# Altium schematic sheet SCH-Jamme.SchDoc: JAMMER
size A2; Address1: Seyyed Mohammad Sadr; Address2: msadr471@gmail.com; Address3: Electronics.mihanblog.com; DocumentNumber: 1; SheetNumber: 1; SheetTotal: Sadr
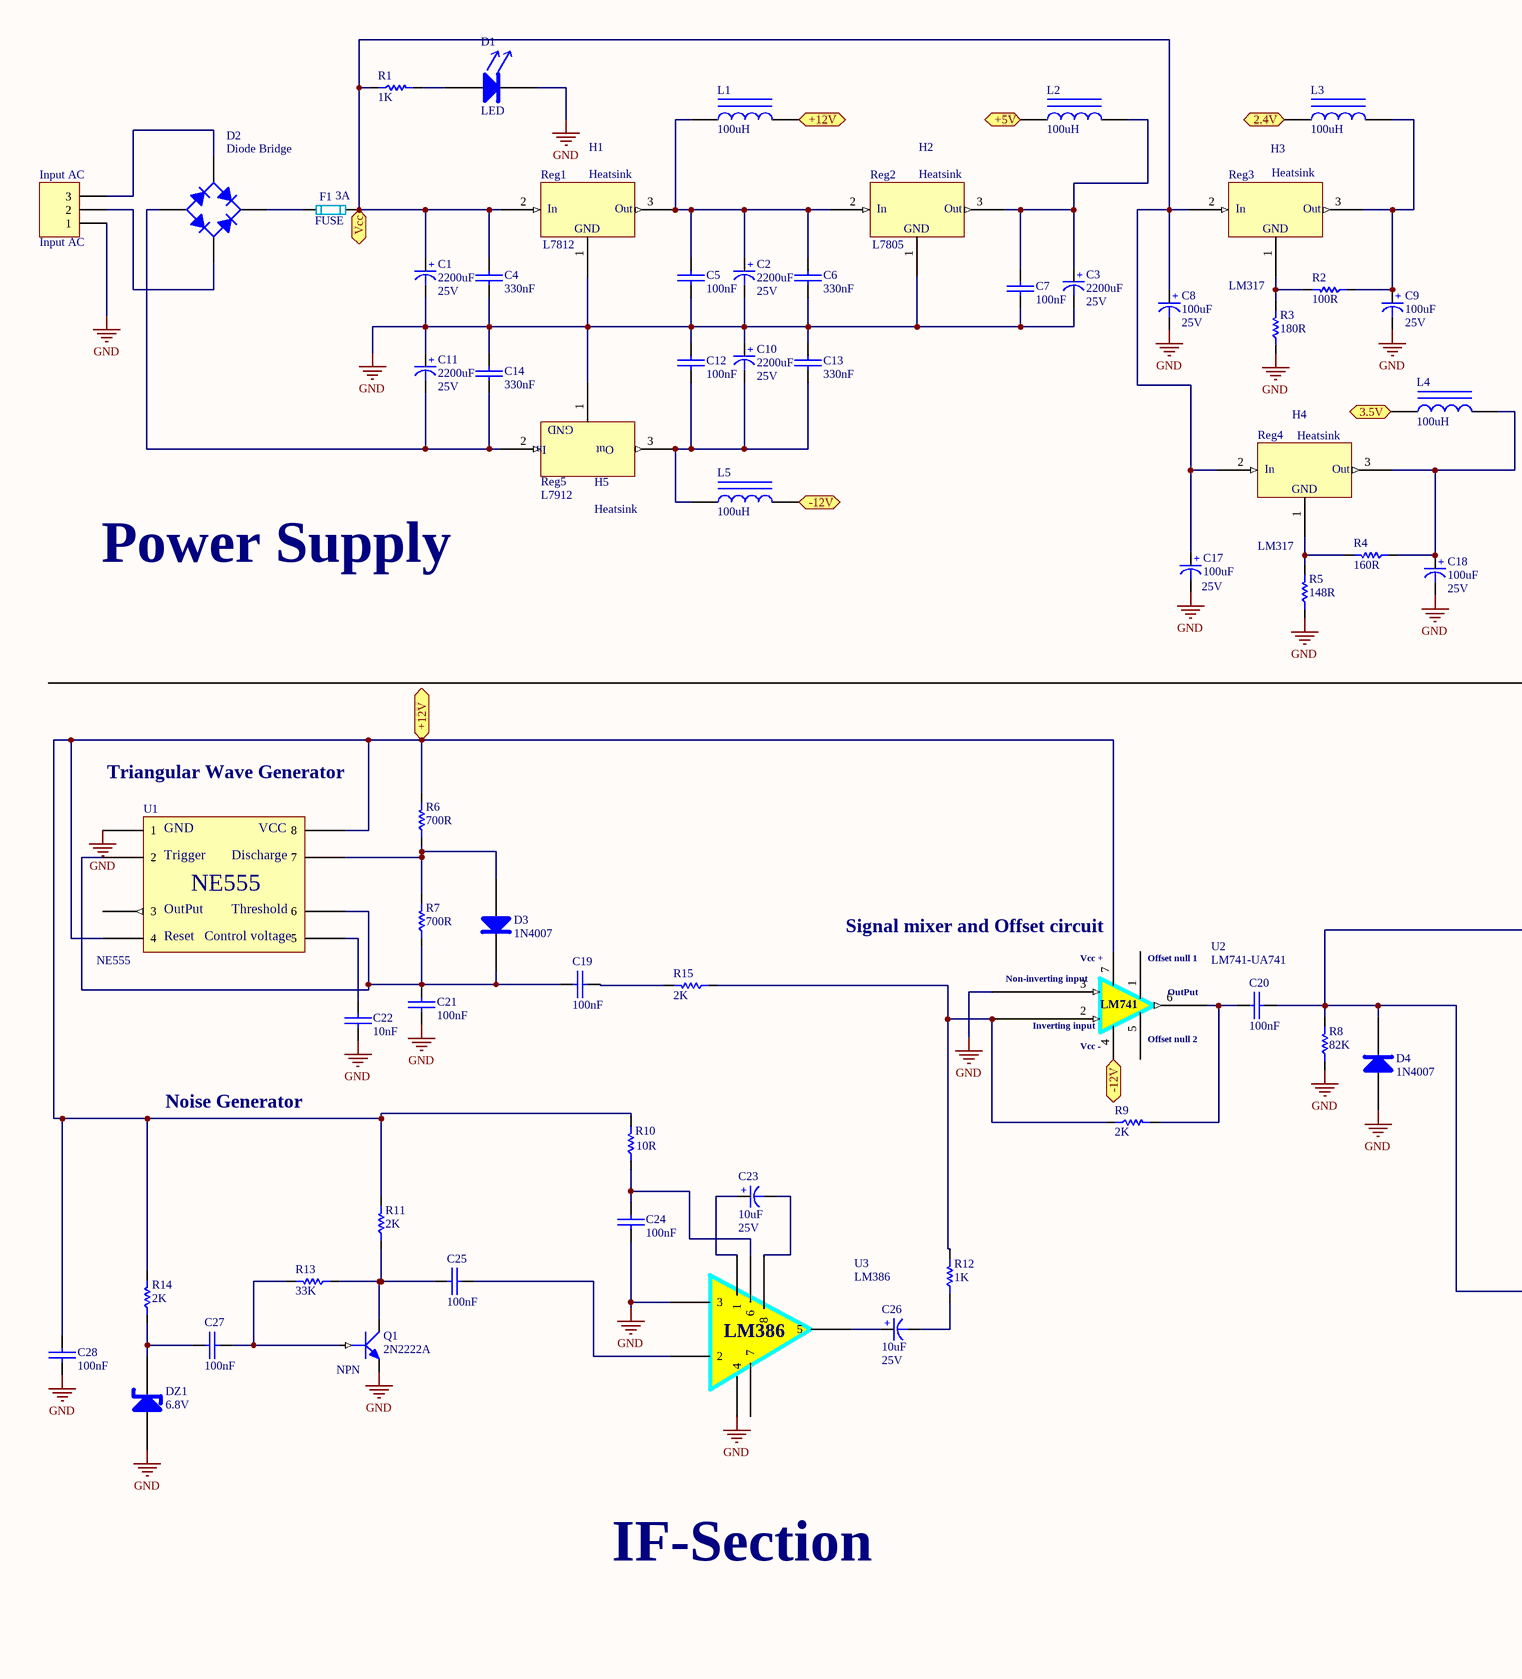
[diagram p0: SCH-Jamme.SchDoc, left]
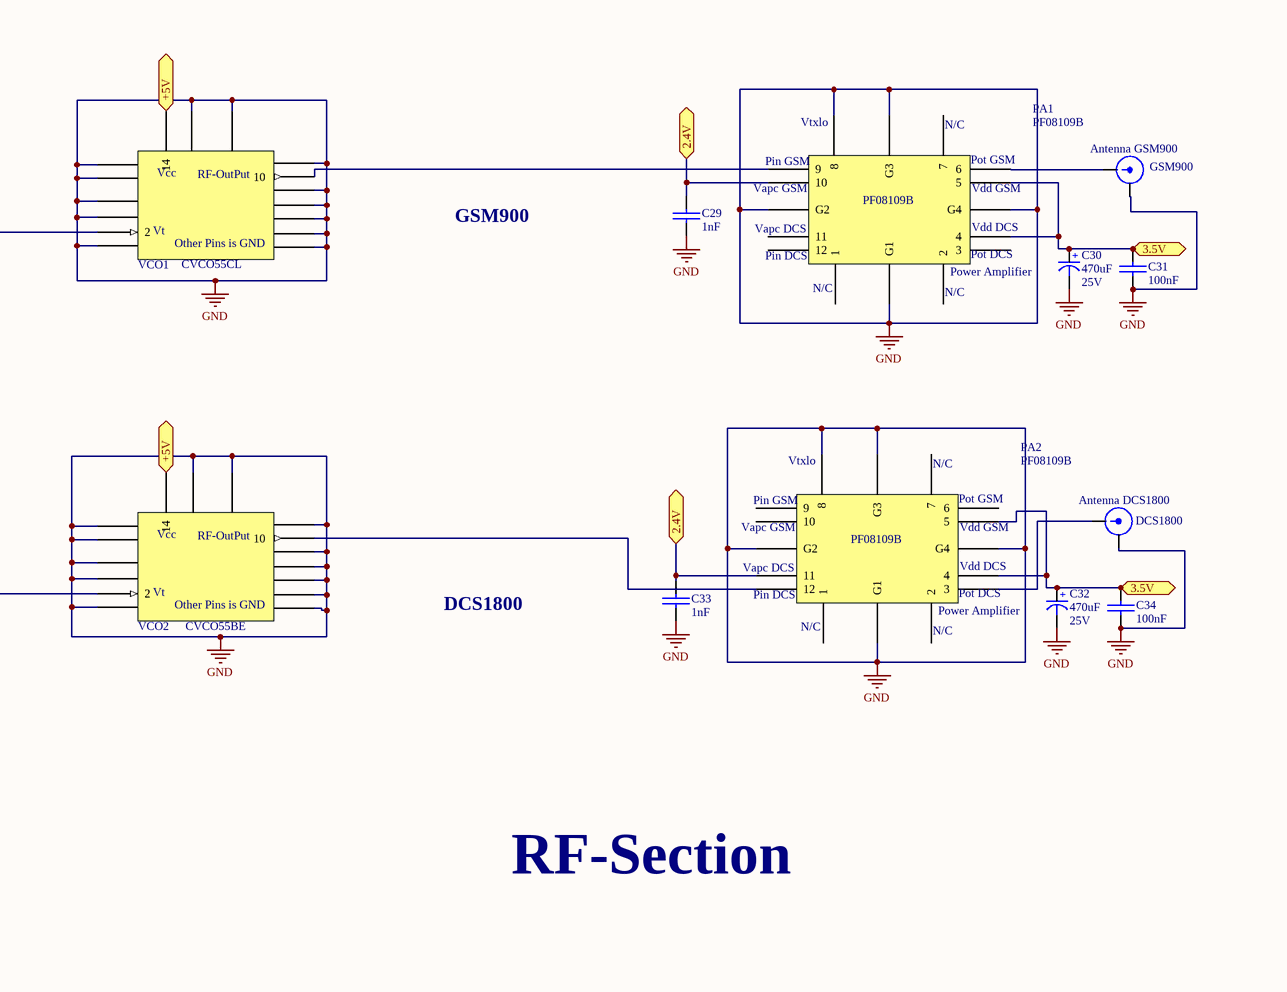
[diagram p1: SCH-Jamme.SchDoc, right]

## Parts
Antenna_DCS1800  DCS1800  [BNC - Connector]
Antenna_GSM900  GSM900  [BNC - Connector]
C1  Voltage: 25V  [cap 04]  (hidden comment: 2200uF)
C2  Voltage: 25V  [cap 04]  (hidden comment: 2200uF)
C3  Voltage: 25V  [cap 04]  (hidden comment: 2200uF)
C4  330nF  [Cap - 100nF - 2]
C5  100nF  [Cap - 100nF - 2]
C6  330nF  [Cap - 100nF - 2]
C7  100nF  [Cap - 100nF - 2]
C8  Voltage: 25V  [cap 04]  (hidden comment: 100uF)
C9  Voltage: 25V  [cap 04]  (hidden comment: 100uF)
C10  Voltage: 25V  [cap 04]  (hidden comment: 2200uF)
C11  Voltage: 25V  [cap 04]  (hidden comment: 2200uF)
C12  100nF  [Cap - 100nF - 2]
C13  330nF  [Cap - 100nF - 2]
C14  330nF  [Cap - 100nF - 2]
C17  Voltage: 25V  [cap 04]  (hidden comment: 100uF)
C18  Voltage: 25V  [cap 04]  (hidden comment: 100uF)
C19  100nF  [Cap - 100nF - 2]
C20  100nF  [Cap - 100nF - 2]
C21  100nF  [Cap - 100nF - 2]
C22  10nF  [Cap - 100nF - 2]
C23  Voltage: 25V  [cap 01]  (hidden comment: 10uF)
C24  100nF  [Cap - 100nF - 2]
C25  100nF  [Cap - 100nF - 2]
C26  Voltage: 25V  [cap 01]  (hidden comment: 10uF)
C27  100nF  [Cap - 100nF - 2]
C28  100nF  [Cap - 100nF - 2]
C29  1nF  [Cap - 100nF - 2]
C30  Voltage: 25V  [cap 03]  (hidden comment: 470uF)
C31  100nF  [Cap - 100nF - 2]
C32  Voltage: 25V  [cap 03]  (hidden comment: 470uF)
C33  1nF  [Cap - 100nF - 2]
C34  100nF  [Cap - 100nF - 2]
D1  LED  [GREEN LED 5mm]
D2  Diode Bridge  [Diode Bridge]
D3  1N4007  [DO-41]
D4  1N4007  [DO-41]
DZ1  6.8V  [DO-41]
F1  FUSE  Current: 3A  [FUSE_1]
H1  Heatsink  [Heatsink 2PIN]
H2  Heatsink  [Heatsink 2PIN]
H3  Heatsink  [Heatsink 2PIN]
H4  Heatsink  [Heatsink 2PIN]
H5  Heatsink  [Heatsink 2PIN]
Input_AC  Input AC  [HDR1X3]
L1  100uH  [Res-(1/1)]
L2  100uH  [Res-(1/1)]
L3  100uH  [Res-(1/1)]
L4  100uH  [Res-(1/1)]
L5  100uH  [Res-(1/1)]
PA1  PF08109B  [RF-O-12]
PA2  PF08109B  [RF-O-12]
Q1  2N2222A  [TO52]
R1  1K  [Res-(1/4)]
R2  100R  [Res-(1/4)]
R3  180R  [Res-(1/4)]
R4  160R  [Res-(1/4)]
R5  148R  [Res-(1/4)]
R6  700R  [Res-(1/4)]
R7  700R  [Res-(1/4)]
R8  82K  [Res-(1/4)]
R9  2K  [Res-(1/4)]
R10  10R  [Res-(1/4)]
R11  2K  [Res-(1/4)]
R12  1K  [Res-(1/4)]
R13  33K  [Res-(1/4)]
R14  2K  [Res-(1/4)]
R15  2K  [Res-(1/4)]
Reg1  L7812  [TO-220]
Reg2  L7805  [TO-220]
Reg3  LM317  [TO-220]
Reg4  LM317  [TO-220]
Reg5  L7912  [TO-220]
U1  NE555  [DIP8]
U2  LM741-UA741  [DIP8]
U3  LM386  [DIP8]
VCO1  CVCO55CL  [CVCO55CL]
VCO2  CVCO55BE  [CVCO55BE]

## Ports
2.4V, 3.5V, +5V, +12V, -12V, Vcc (bidir)

## Nets
GND: Antenna_DCS1800.2 Antenna_GSM900.2 C1.2(-) C2.2(-) C3.2(-) C4.2(-) C5.2(-) C6.2(-) C7.2(-) C8.2(-) C9.2(-) C10.1(+) C11.1(+) C12.1(+) C13.1(+) C14.1(+) C17.2(-) C18.2(-) C21.2(-) C22.2(-) C24.2(-) C28.2(-) C29.2(-) C30.2(-) C31.2(-) C32.2(-) C33.2(-) C34.2(-) D1.2 D4.1 DZ1.1 Input_AC.1 PA1.8 PA1.G1 PA1.G2 PA1.G3 PA1.G4 PA2.8 PA2.G1 PA2.G2 PA2.G3 PA2.G4 Q1.1(E) R3.1 R5.1 R8.1 Reg1.1 Reg2.1 Reg5.1 U1.1 U2.3 U3.3 U3.4 VCO1.1 VCO1.3 VCO1.4 VCO1.5 VCO1.6 VCO1.7 VCO1.8 VCO1.9 VCO1.11 VCO1.12 VCO1.13 VCO1.15 VCO1.16 VCO2.1 VCO2.3 VCO2.4 VCO2.5 VCO2.6 VCO2.7 VCO2.8 VCO2.9 VCO2.11 VCO2.12 VCO2.13 VCO2.15 VCO2.16
2.4V: C29.1(+) C33.1(+) L3.1 PA1.10 PA2.11 ; port 2.4V
3.5V: C30.1(+) C31.1(+) C32.1(+) C34.1(+) L4.1 PA1.4 PA1.5 PA2.4 PA2.5 ; port 3.5V
+5V: L2.1 VCO1.14 VCO2.14 ; port +5V
+12V: C28.1(+) L1.2 R6.2 R10.2 R11.2 R14.2 U1.4 U1.8 U2.7 ; port +12V
-12V: L5.2 U2.4 ; port -12V
Vcc: C1.1(+) C4.1(+) C8.1(+) C17.1(+) F1.2 R1.1 Reg1.2 Reg3.2 Reg4.2 ; port Vcc
NetAntenna_DCS1800_1: Antenna_DCS1800.1 PA2.3
NetAntenna_GSM900_1: Antenna_GSM900.1 PA1.6
NetC2_1: C2.1(+) C5.1(+) C6.1(+) L1.1 Reg1.3 Reg2.2
NetC3_1: C3.1(+) C7.1(+) L2.2 Reg2.3
NetC9_1: C9.1(+) L3.2 R2.1 Reg3.3
NetC10_2: C10.2(-) C12.2(-) C13.2(-) L5.1 Reg5.3
NetC11_2: C11.2(-) C14.2(-) D2.3(A) Reg5.2
NetC18_1: C18.1(+) L4.2 R4.1 Reg4.3
NetC19_1: C19.1(+) C21.1(+) D3.2 R7.1 U1.2 U1.6
NetC19_2: C19.2(-) R15.2
NetC20_1: C20.1(+) R9.2 U2.6
NetC20_2: C20.2(-) D4.2 R8.2 VCO1.2 VCO2.2
NetC22_1: C22.1(+) U1.5
NetC23_1: C23.1(+) U3.1
NetC23_2: C23.2(-) U3.8
NetC24_1: C24.1(+) R10.1 U3.6
NetC25_1: C25.1(+) Q1.3(C) R11.1 R13.1
NetC25_2: C25.2(-) U3.2
NetC26_1: C26.1(+) U3.5
NetC26_2: C26.2(-) R12.1
NetC27_1: C27.1(+) DZ1.2 R14.1
NetC27_2: C27.2(-) Q1.2(B) R13.2
NetD1_1: D1.1 R1.2
NetD2_1: D2.1(K) F1.1
NetD2_2: D2.2(C) Input_AC.2
NetD2_4: D2.4(C) Input_AC.3
NetD3_1: D3.1 R6.1 R7.2 U1.7
NetPA1_9: PA1.9 VCO1.10
NetPA2_12: PA2.12 VCO2.10
NetR2_2: R2.2 R3.2 Reg3.1
NetR4_2: R4.2 R5.2 Reg4.1
NetR9_1: R9.1 R12.2 R15.1 U2.2

Not connected (* = marked no-connect by the designer): PA1 1 2 3 7 11 12; PA2 1 2 6 7 9 10; U1 3; U2 1 5; U3 7

## Notes on the sheet
- Power Supply
- (near U1) Triangular Wave Generator
- GSM900
- (near U2) Signal mixer and Offset circuit
- Noise Generator
- DCS1800
- IF-Section
- RF-Section
- Title
- Size:
- Date:
- File:
- A2
- Number:
- Time:
- Revision:
- Sheet
- of
- (in symbol 2N2222A) NPN
- (in symbol CVCO055BE) Vcc; RF-OutPut; Vt; Other Pins is GND
- (in symbol CVCO055CL) Vcc; RF-OutPut; Vt; Other Pins is GND
- (in symbol LM741-UA741) Vcc +; Offset null 1; Non-inverting input; OutPut; LM741; Inverting input; Offset null 2; Vcc -
- (in symbol NE555) GND; VCC; Trigger; Discharge; OutPut; Threshold; Reset; Control voltage
- (in symbol Power Amplifier) Vtxlo; N/C; Pin GSM; Pot GSM; Vapc GSM; Vdd GSM; Vapc DCS; Vdd DCS; Pin DCS; Pot DCS
- (in symbol Voltage Regulator) In; Out; GND

## Library data of the parts
Antenna_DCS1800 = BNC: Antenna DCS1800; designer: Saeid Jorablo; Company: ACR; adding date: 2009-12-19; Band: DCS1800
Antenna_GSM900 = BNC: Antenna GSM900; designer: Saeid Jorablo; Company: ACR; adding date: 2009-12-19; Band: GSM900
C1-C3 C8-C11 C17 C18 C23 C26 C30 C32 = Cap-Polar: Capacitor Electrolytic; Designer: Saeid Jorablo; Organazation: ControTec; Adding Date: 1387/12/20
  C1-C3 C10 C11: Value: 2200uF
  C8 C9 C17 C18: Value: 100uF
  C23 C26: Value: 10uF
  C30 C32: Value: 470uF
C4-C7 C12-C14 C19-C22 C24 C25 C27 C28 = Cap-Bipolar: Capacitor Ceramic; Voltage: 100V; Designer: Saeid Jorablo; Organazation: ControTec; Adding Date: 1387/12/20
  C4 C6 C13 C14: Value: 330nF
  C5 C7 C12 C19-C21 C24 C25 C27 C28: Value: 100nF
  C22: Value: 10nF
C29 C31 C33 C34 = Cap-Bipolar: Capacitor ceramic; Voltage: 100V; Designer: Saeid Jorablo; Organazation: ControTec; Adding Date: 1387/12/20
  C29 C33: Value: 1nF
  C31 C34: Value: 100nF
D1 = LED Full color: Voltage: 3V; Current: 3mA; Color: Full coulor
D2 = Diode Bridge: Full Wave Diode Bridge; Company: E.P.I.L; Design Date: 2011/11/02
D3 D4 = 1N4007: Rectifiers; Curent: 1A; Voltage: 1000V
DZ1 = 1N4728A: Diode Zener; Curent: 76mA; Voltage Zener: 6.8V
Input_AC = Header 3: Header, 3-Pin; LatestRevisionDate: 17-Jul-2002; LatestRevisionNote: Re-released for DXP Platform.; Publisher: Altium Limited
L1-L5 = Inductor Iron: Magnetic-Core Inductor; Published: 24-Mar-1999; LatestRevisionDate: 17-Jul-2002; LatestRevisionNote: Re-released for DXP Platform.; PackageReference: AXIAL-0.9; Publisher: Altium Limited; PackageDescription: Axial Device, Thru-Hole; 2 Leads; 0.9 in Pin Spacing; Value: 100uH
PA1 PA2 = Power Amplifier: Supply voltage: 5V; Supply current - Idd GSM: 3A; Supply current - Idd DCS: 2A; Vtxlo voltage: 4V; Input power: 10dBm; Operating case temperature: -30 to +100 °C; Output power: Put GSM 5W; Output power: Pout DCS 3W; Vapc voltage: 4V; Storage temperature: -30 to +100 °C
Q1 = 2N2222A: NPN Transistor_Created by DESIGNER (M.Hariri)
R1-R5 = Resistor: Tolerance: 5%; Power: 1/8 W
  R1: Value: 1K
  R2: Value: 100R
  R3: Value: 180R
  R4: Value: 160R
  R5: Value: 148R
R6-R15 = Resistor: Resistor 1/4W; Tolerance: 5%; Power: 1/8 W
  R6 R7: Value: 700R
  R8: Value: 82K
  R9 R11 R14 R15: Value: 2K
  R10: Value: 10R
  R12: Value: 1K
  R13: Value: 33K
Reg1-Reg5 = Voltage Regulator: TO-220
U1 = NE555: GENERAL PURPOSE SINGLE BIPOLAR TIMERS; Vcc - Supply Voltage: 4.5 to 18 V; Ic - SE555: 12 mA; Ic - NE555 SA555: 15 mA; Control Voltage level: 11 V; Threshold Voltage: 11.2 V; Trigger Voltage: 5.6 V; Trigger Current: 2 uA; Reset Voltage: 1 V; Reset Current: 1.5 mA
U2 = LM741-UA741: (OP-AMP)
U3 = LM386: Audio Amplifier
VCO1 = CVCO055CL: SMD; Lower Frequency: 0970 MHz; Upper Frequency: 0925 MHz
VCO2 = CVCO055BE: SMD; Lower Frequency: 1785 MHz; Upper Frequency: 1900 MHz